# EAGLE design dresden_breakout_v02b (EAGLE 5.10)
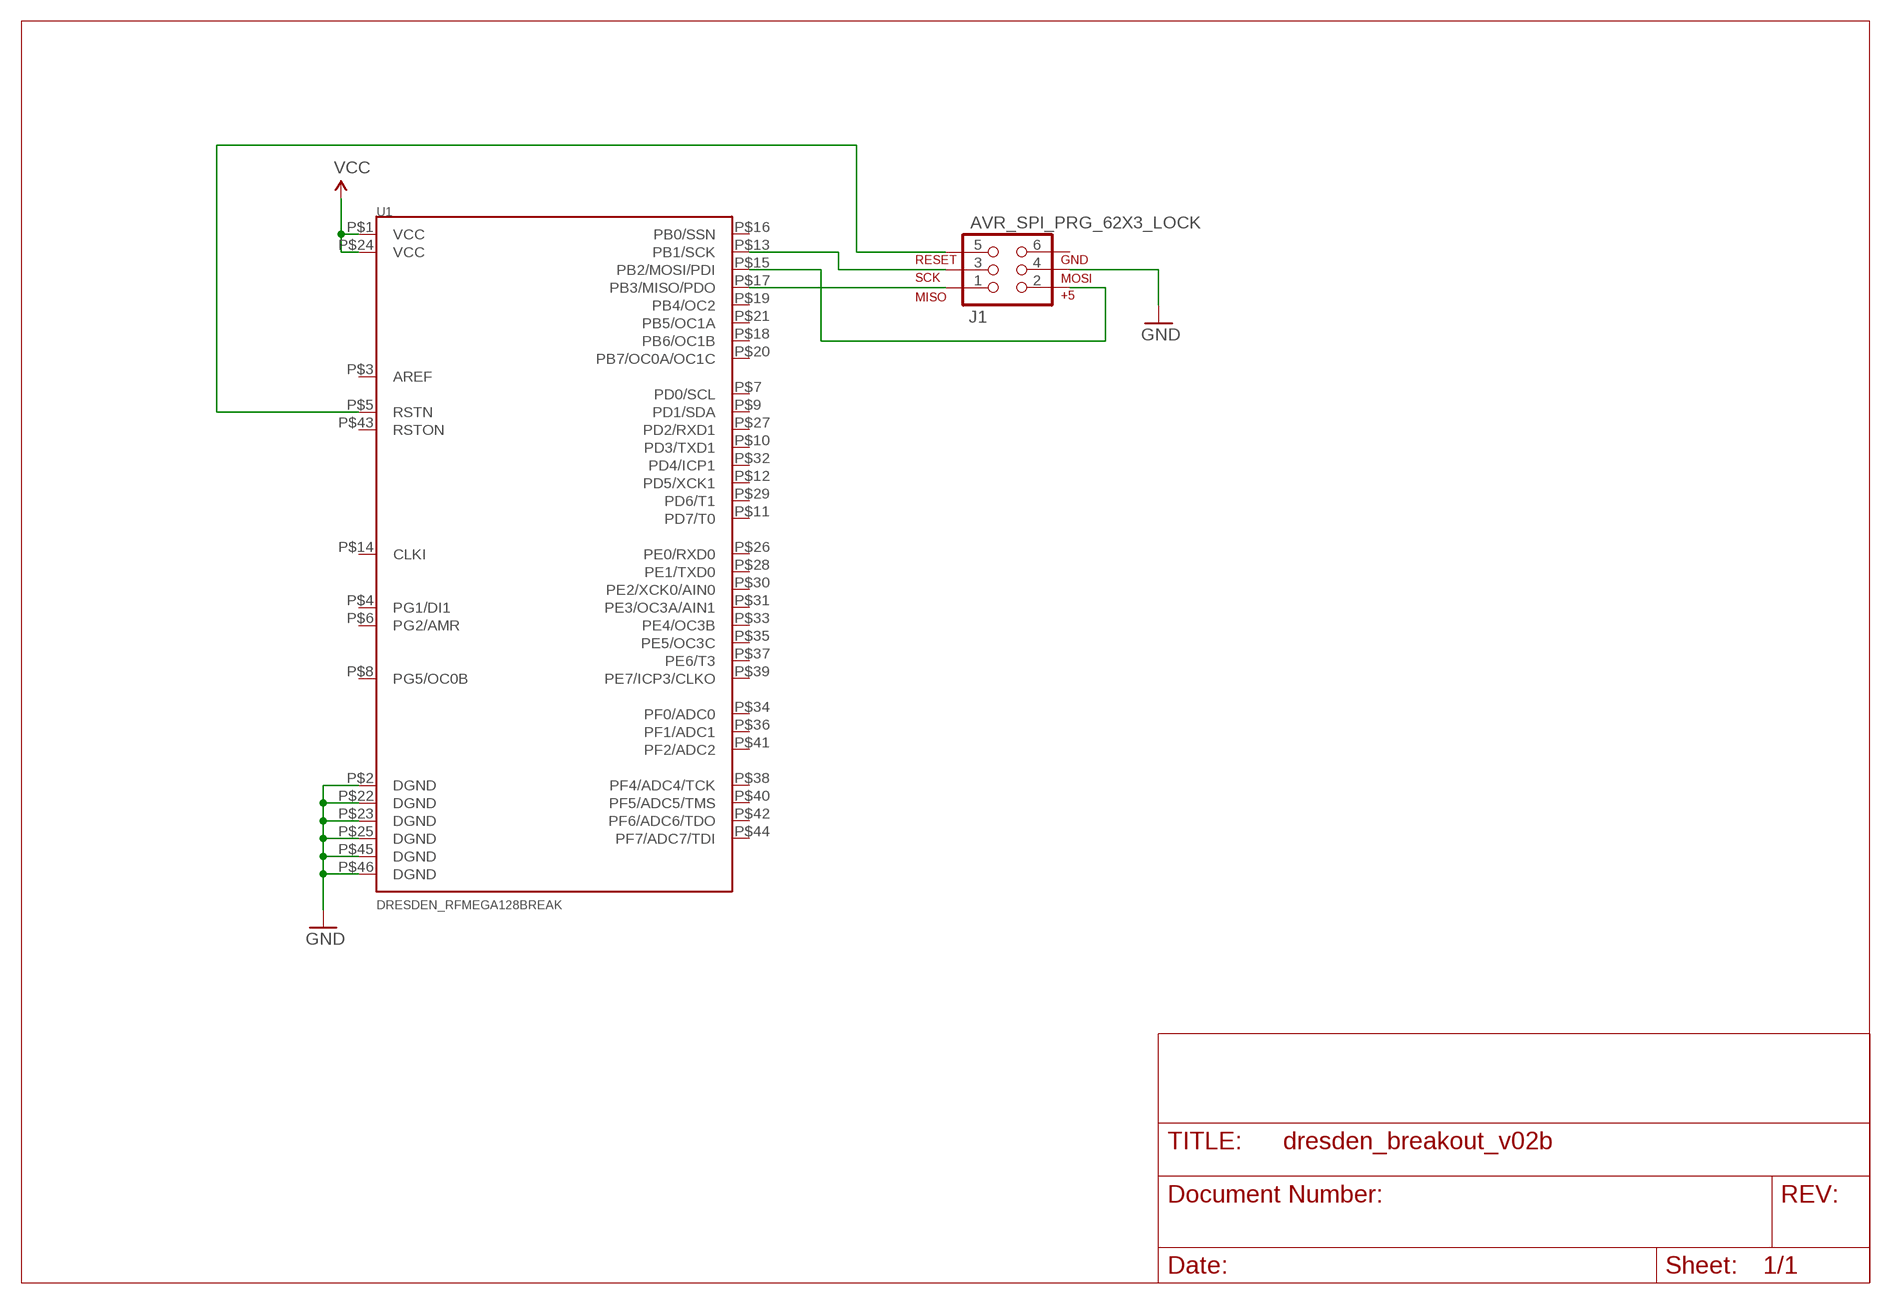
[diagram p0: schematic, sheet 1]

## Parts
J1  AVR_SPI_PRG_62X3_LOCK  [2X3_LOCK]
U1  DRESDEN_RFMEGA128BREAK  [DRESDEN-DERFMEGA128-BREAK]

## Nets
GND: J1.4 U1.P$2(DGND) U1.P$22(DGND) U1.P$23(DGND) U1.P$25(DGND) U1.P$45(DGND) U1.P$46(DGND)
MISO: J1.1 U1.P$17(PB3/MISO/PDO)
MOSI: J1.2 U1.P$15(PB2/MOSI/PDI)
RESET: J1.5 U1.P$5(RSTN)
SCK: J1.3 U1.P$13(PB1/SCK)
VCC: U1.P$1(VCC) U1.P$24(VCC)
Unconnected: J1.6 U1.P$3(AREF) U1.P$4(PG1/DI1) U1.P$6(PG2/AMR) U1.P$7(PD0/SCL) U1.P$8(PG5/OC0B) U1.P$9(PD1/SDA) U1.P$10(PD3/TXD1) U1.P$11(PD7/T0) U1.P$12(PD5/XCK1) U1.P$14(CLKI) U1.P$16(PB0/SSN) U1.P$18(PB6/OC1B) U1.P$19(PB4/OC2) U1.P$20(PB7/OC0A/OC1C) U1.P$21(PB5/OC1A) U1.P$26(PE0/RXD0) U1.P$27(PD2/RXD1) U1.P$28(PE1/TXD0) U1.P$29(PD6/T1) U1.P$30(PE2/XCK0/AIN0) U1.P$31(PE3/OC3A/AIN1) U1.P$32(PD4/ICP1) U1.P$33(PE4/OC3B) U1.P$34(PF0/ADC0) U1.P$35(PE5/OC3C) U1.P$36(PF1/ADC1) U1.P$37(PE6/T3) U1.P$38(PF4/ADC4/TCK) U1.P$39(PE7/ICP3/CLKO) U1.P$40(PF5/ADC5/TMS) U1.P$41(PF2/ADC2) U1.P$42(PF6/ADC6/TDO) U1.P$43(RSTON) U1.P$44(PF7/ADC7/TDI)

## Library data of the parts
J1 = SparkFun:AVR_SPI_PRG_6: AVR ISP 6 Pin This is the reduced ISP connector for AVR programming. Common on Arduino. This footprint will take up less PCB space and can be used with a 10-pin to 6-pin adapter such as SKU: BOB-08508
U1 = karlnet-parts:DRESDEN_RFMEGA128: This is a modified ATmega128RFA1 part, to to match Dresden Elektronik's deRFmega128-22XX modules

## Board
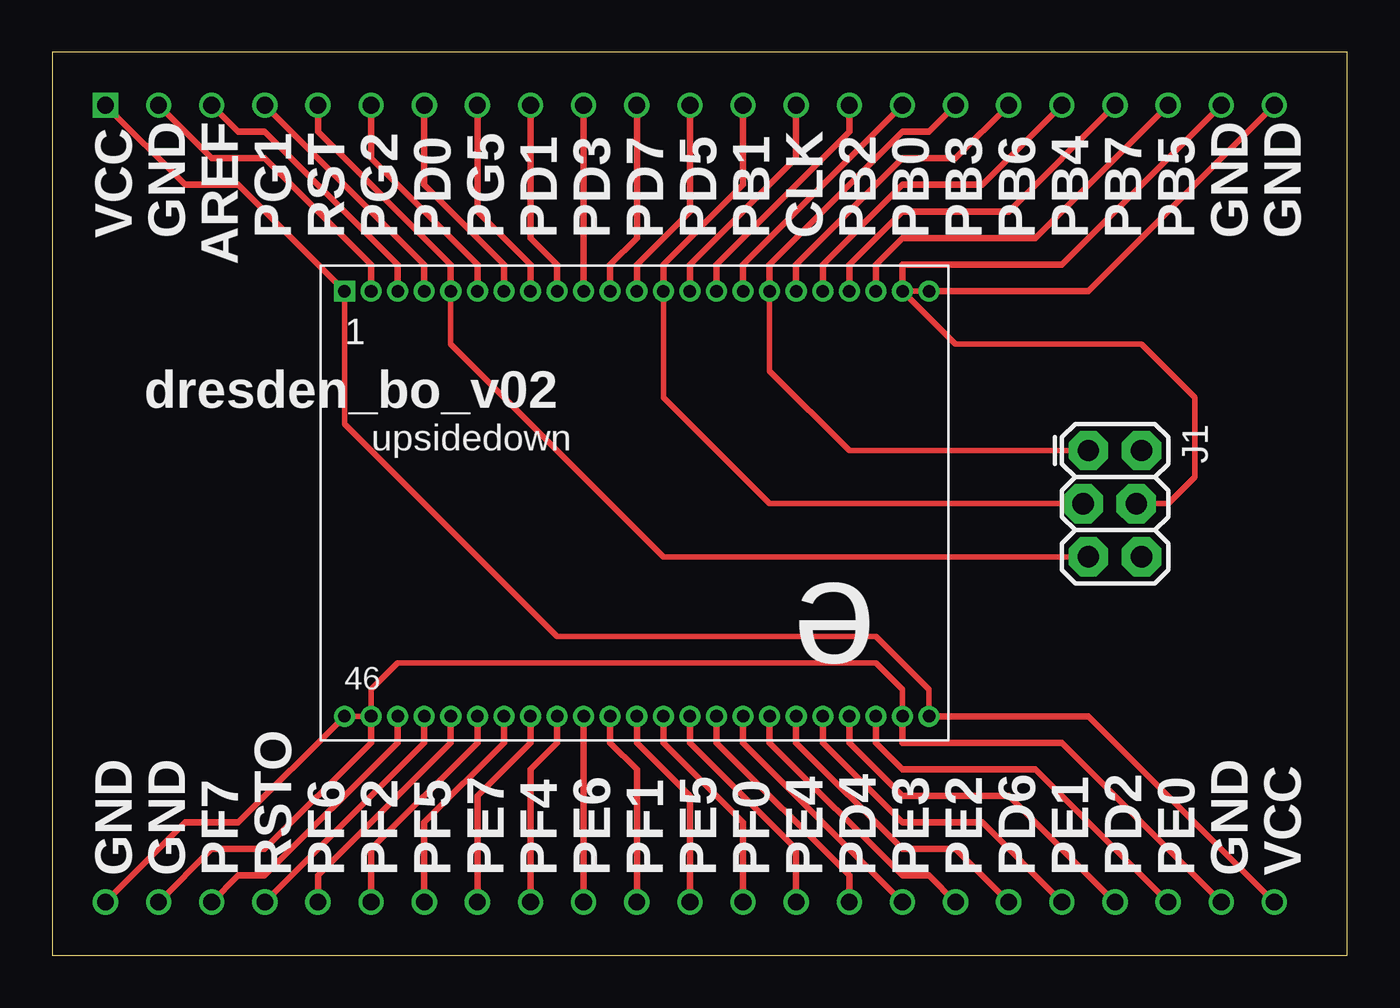
[diagram p1: board, top side]
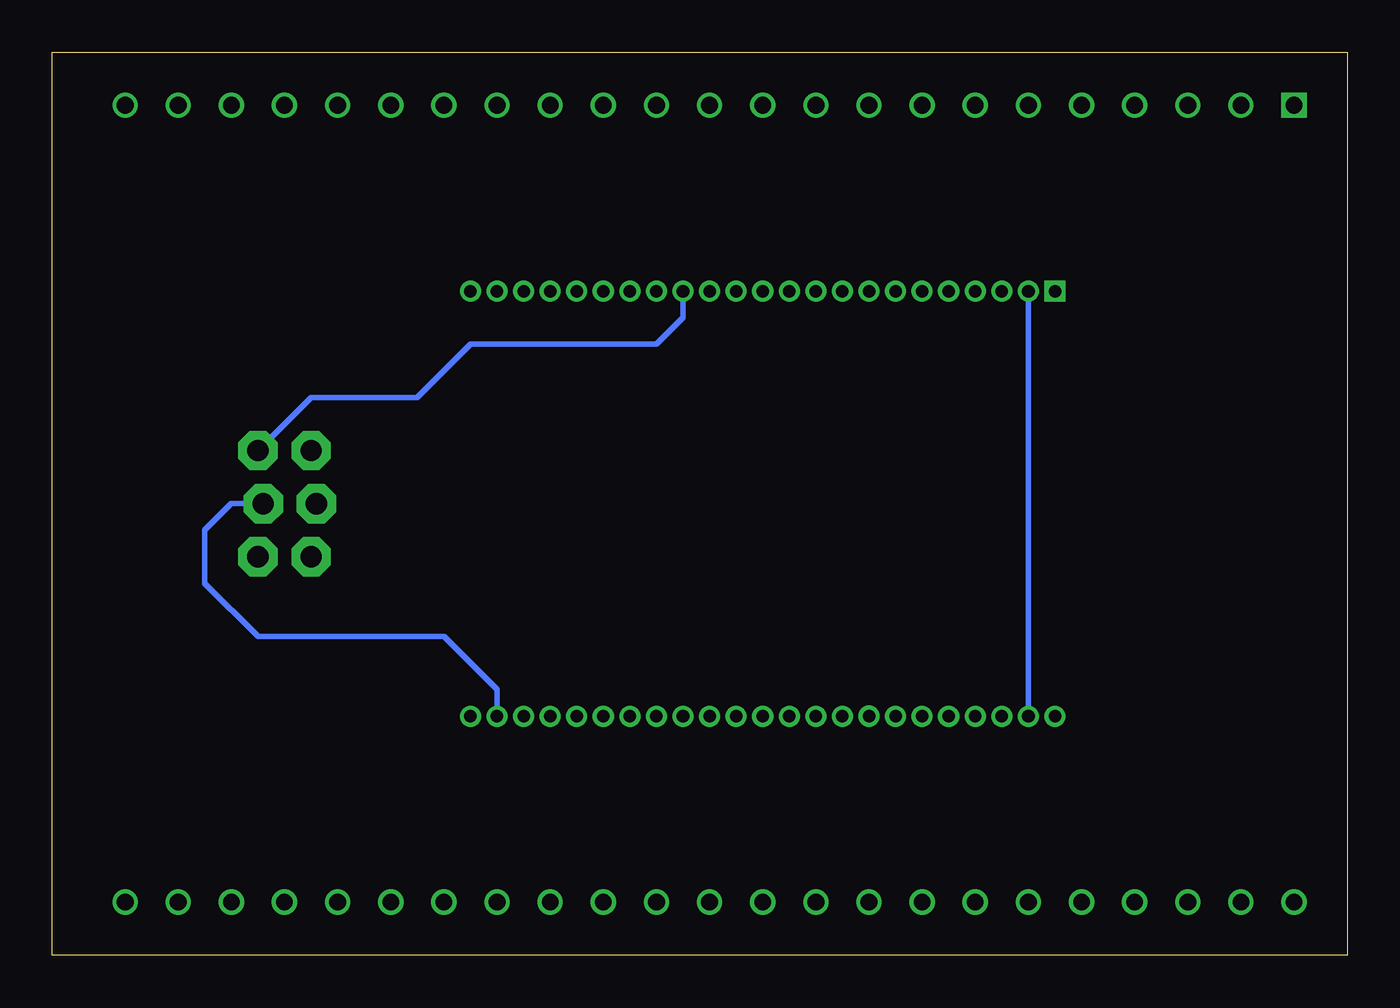
[diagram p2: board, bottom side, seen from below]

Size 61.9 x 43.17 mm. Coordinates in mm from the lower left corner, seen from the top.
Outline: 0,0 61.9,0 61.9,43.17 0,43.17 0,0
Copper layers (1*16): Top 0.035mm / dielectric 1.5mm / Bottom 0.035mm
Design rules "olimex-8mils *": minimum track width 8mil, minimum drill 0.6mm, track to track 8mil, track to pad 8mil, pad to pad 8mil, via to via 8mil, smd to smd 8mil, copper to edge 40mil, drill to drill 10mil, minimum pad ring 8mil, minimum via ring 8mil, stop-mask expansion 0mil, vias tented up to drill 0mil, thermal gap 10mil

### Footprints (pad centres in the part's own frame; a part is rotated, then mirrored left to right if it is on the bottom)
2X3_LOCK = drill 1.016 pad 1.88 octagon: 1 0,0; 2 0,2.54; 3 2.54,-0.254; 4 2.54,2.286; 5 5.08,0; 6 5.08,2.54
DRESDEN-DERFMEGA128-BREAK = drill 0.8 square: 1 -21.59,22.86 | drill 0.8 round: 2 -19.05,22.86; 3 -16.51,22.86; 4 -13.97,22.86; 5 -11.43,22.86; 6 -8.89,22.86; 7 -6.35,22.86; 8 -3.81,22.86; 9 -1.27,22.86; 10 1.27,22.86; 11 3.81,22.86; 12 6.35,22.86; 13 8.89,22.86; 14 11.43,22.86; 15 13.97,22.86; 16 16.51,22.86; 17 19.05,22.86; 18 21.59,22.86; 19 24.13,22.86; 20 26.67,22.86; 21 29.21,22.86; 22 31.75,22.86; 23 34.29,22.86; 24 34.29,-15.24; 25 31.75,-15.24; 26 29.21,-15.24; 27 26.67,-15.24; 28 24.13,-15.24; 29 21.59,-15.24; 30 19.05,-15.24; 31 16.51,-15.24; 32 13.97,-15.24; 33 11.43,-15.24; 34 8.89,-15.24; 35 6.35,-15.24; 36 3.81,-15.24; 37 1.27,-15.24; 38 -1.27,-15.24; 39 -3.81,-15.24; 40 -6.35,-15.24; 41 -8.89,-15.24; 42 -11.43,-15.24; 43 -13.97,-15.24; 44 -16.51,-15.24; 45 -19.05,-15.24; 46 -21.59,-15.24 | drill 0.6 pad 1.006 square: P$1 -10.16,13.97 | drill 0.6 pad 1.006 round: P$2 -8.89,13.97; P$3 -7.62,13.97; P$4 -6.35,13.97; P$5 -5.08,13.97; P$6 -3.81,13.97; P$7 -2.54,13.97; P$8 -1.27,13.97; P$9 0,13.97; P$10 1.27,13.97; P$11 2.54,13.97; P$12 3.81,13.97; P$13 5.08,13.97; P$14 6.35,13.97; P$15 7.62,13.97; P$16 8.89,13.97; P$17 10.16,13.97; P$18 11.43,13.97; P$19 12.7,13.97; P$20 13.97,13.97; P$21 15.24,13.97; P$22 16.51,13.97; P$23 17.78,13.97; P$24 17.78,-6.35; P$25 16.51,-6.35; P$26 15.24,-6.35; P$27 13.97,-6.35; P$28 12.7,-6.35; P$29 11.43,-6.35; P$30 10.16,-6.35; P$31 8.89,-6.35; P$32 7.62,-6.35; P$33 6.35,-6.35; P$34 5.08,-6.35; P$35 3.81,-6.35; P$36 2.54,-6.35; P$37 1.27,-6.35; P$38 0,-6.35; P$40 -2.54,-6.35; P$41 -3.81,-6.35; P$42 -5.08,-6.35; P$43 -6.35,-6.35; P$44 -7.62,-6.35; P$45 -8.89,-6.35; P$46 -10.16,-6.35 | drill 0.6 pad 1.016 round: P$39 -1.27,-6.35

### Placement (x,y rotation side)
J1  49.53,24.13 270 top
U1  24.13,17.78 0 top

### Tracks (layer width: path | path; a pad name or v marks a point on that pad's centre or on a via)
GND
  Top 0.254: U1.P$23 U1.P$22 43.18,29.21 52.07,29.21 54.61,26.67 54.61,22.86 53.34,21.59 J1.4 | U1.P$46 U1.P$45 15.24,12.7 16.51,13.97 39.37,13.97 40.64,12.7 U1.P$25
  Bottom 0.254: U1.P$45 U1.P$2 | U1.P$25 40.64,12.7 43.18,15.24 52.07,15.24 54.61,17.78 54.61,20.32 53.34,21.59 J1.4
MISO
  Top 0.254: U1.P$17 34.29,27.94 38.1,24.13 J1.1
MOSI
  Bottom 0.254: U1.P$15 31.75,30.48 33.02,29.21 41.91,29.21 44.45,26.67 49.53,26.67 J1.2
RESET
  Top 0.254: J1.5 29.21,19.05 19.05,29.21 U1.P$5
SCK
  Top 0.254: U1.P$13 29.21,26.67 34.29,21.59 J1.3
VCC
  Top 0.254: U1.P$24 41.91,12.7 39.37,15.24 24.13,15.24 13.97,25.4 U1.P$1

### Text on the board
tPlace: VCC | GND | PG1 | RST | PG2 | PD0 | PG5 | PD1 | PD3 | PD7 | PD5 | PB1 | CLK | PB2 | PB0 | PB3 | PB6 | PB4 | PB7 | PB5 | GND | GND | AREF | dresden_bo_v02 | GND | GND | PF7 | RSTO | PF6 | PF2 | PF5 | PE7 | PF4 | PE6 | PF1 | PE5 | PF0 | PE4 | PD4 | PE3 | PE2 | PD6 | PE1 | PD2 | PE0 | GND | VCC